# EAGLE schematic flip-clock (EAGLE 6.5.0)
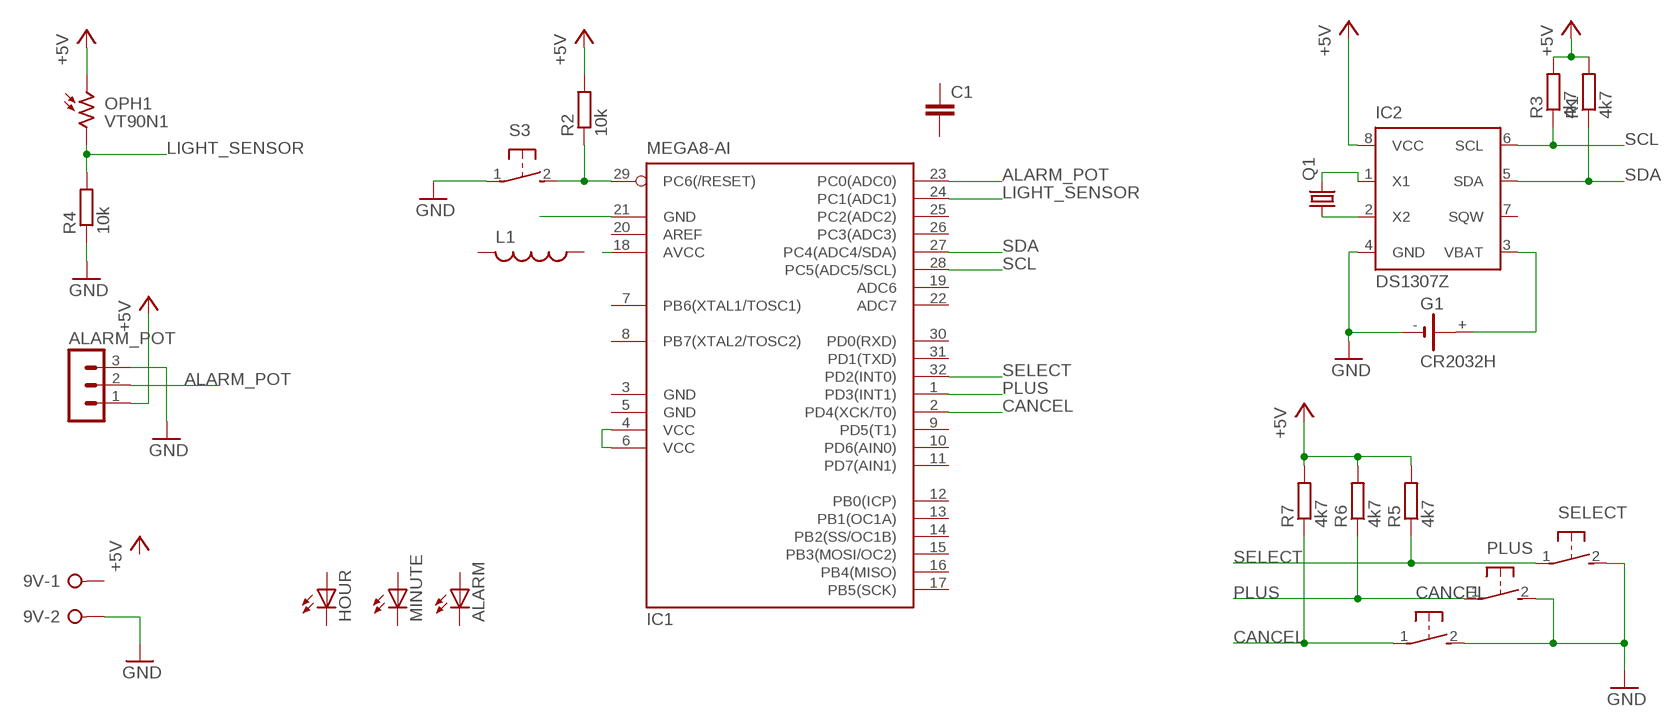
[diagram p0: schematic, sheet 1]

## Parts
9V  W237-02P  [W237-132]
ALARM  LED5MM  [LED5MM]
ALARM_POT  MA03-1  [MA03-1]
C1  C-EUC0805  [C0805]
CANCEL  31-XX  [B3F-31XX]
G1  CR2032H  [CR2032H]
HOUR  LED5MM  [LED5MM]
IC1  MEGA8-AI  [TQFP32-08]
IC2  DS1307Z  [SOIC8]
L1  L-US0204/7  [0204/7]
MINUTE  LED5MM  [LED5MM]
OPH1  VT90N1  [VT900]
PLUS  31-XX  [B3F-31XX]
Q1  CRYSTALTC26H  [TC26H]
R1  4k7  R-EU_M0805  [M0805]
R2  10k  R-EU_M0805  [M0805]
R3  4k7  R-EU_M0805  [M0805]
R4  10k  R-EU_M0805  [M0805]
R5  4k7  R-EU_M0805  [M0805]
R6  4k7  R-EU_M0805  [M0805]
R7  4k7  R-EU_M0805  [M0805]
S3  31-XX  [B3F-31XX]
SELECT  31-XX  [B3F-31XX]

## Nets
+5V: ALARM_POT.1 IC2.8(VCC) OPH1.1 R1.2 R2.2 R3.2 R5.2 R6.2 R7.2
ALARM_POT: ALARM_POT.2 IC1.23(PC0(ADC0))
CANCEL: CANCEL.1(P) IC1.2(PD4(XCK/T0)) R7.1
GND: 9V.2 ALARM_POT.3 CANCEL.2(S) G1.- IC2.4(GND) PLUS.2(S) R4.1 S3.1(P) SELECT.2(S)
LIGHT_SENSOR: IC1.24(PC1(ADC1)) OPH1.2 R4.2
N$1: IC2.1(X1) Q1.2
N$2: IC2.2(X2) Q1.1
N$3: IC1.29(PC6(/RESET)) R2.1 S3.2(S)
N$4: IC1.4(VCC) IC1.6(VCC)
N$5: IC1.18(AVCC)
N$6: G1.+ IC2.3(VBAT)
N$7: IC1.21(GND)
PLUS: IC1.1(PD3(INT1)) PLUS.1(P) R6.1
SCL: IC1.28(PC5(ADC5/SCL)) IC2.6(SCL) R3.1
SDA: IC1.27(PC4(ADC4/SDA)) IC2.5(SDA) R1.1
SELECT: IC1.32(PD2(INT0)) R5.1 SELECT.1(P)
Unconnected: 9V.1 ALARM.A ALARM.K(C) C1.1 C1.2 G1.+@1(+) HOUR.A HOUR.K(C) IC1.7(PB6(XTAL1/TOSC1)) IC1.8(PB7(XTAL2/TOSC2)) IC1.9(PD5(T1)) IC1.10(PD6(AIN0)) IC1.11(PD7(AIN1)) IC1.12(PB0(ICP)) IC1.13(PB1(OC1A)) IC1.14(PB2(SS/OC1B)) IC1.15(PB3(MOSI/OC2)) IC1.16(PB4(MISO)) IC1.17(PB5(SCK)) IC1.19(ADC6) IC1.20(AREF) IC1.22(ADC7) IC1.25(PC2(ADC2)) IC1.26(PC3(ADC3)) IC1.30(PD0(RXD)) IC1.31(PD1(TXD)) IC2.7(SQW) L1.1 L1.2 MINUTE.A MINUTE.K(C)

## Power pins joined to a net without a drawn wire
GND: IC1.3(GND) IC1.5(GND)

## Library data of the parts
9V = con-wago-508:W237-02P: WAGO SREW CLAMP; OC_FARNELL: unknown; OC_NEWARK: unknown
ALARM HOUR MINUTE = led:LED: LED OSRAM: - CHIPLED LG R971, LG N971, LY N971, LG Q971, LY Q971, LO R971, LY R971 LH N974, LH R974 LS Q976, LO Q976, LY Q976 LO Q996 - Hyper CHIPLED LW Q18S LB Q993, LB Q99A, LB R99A - SideLED LS A670, LO A670, LY A670, LG A670, LP A670 LB A673, LV A673, LT A673, LW A673 LH A674 LY A675 LS A676, LA A676, LO A676, LY A676, LW A676 LS A679, LY A679, LG A679 - Hyper Micro SIDELED® LS Y876, LA Y876, LO Y876, LY Y876 LT Y87S - SmartLED LW L88C, LW L88S LB L89C, LB L89S, LG L890 LS L89K, LO L89K, LY L89K LS L896, LA L896, LO L896, LY L896 - TOPLED LS T670, LO T670, LY T670, LG T670, LP T670 LSG T670, LSP T670, LSY T670, LOP T670, LYG T670 LG T671, LOG T671, LSG T671 LB T673, LV T673, LT T673, LW T673 LH T674 LS T676, LA T676, LO T676, LY T676, LB T676, LH T676, LSB T676, LW T676 LB T67C, LV T67C, LT T67C, LS T67K, LO T67K, LY T67K, LW E67C LS E67B, LA E67B, LO E67B, LY E67B, LB E67C, LV E67C, LT E67C LW T67C LS T679, LY T679, LG T679 LS T770, LO T770, LY T770, LG T770, LP T770 LB T773, LV T773, LT T773, LW T773 LH T774 LS E675, LA E675, LY E675, LS T675 LS T776, LA T776, LO T776, LY T776, LB T776 LHGB T686 LT T68C, LB T68C - Hyper Mini TOPLED® LB M676 - Mini TOPLED Santana® LG M470 LS M47K, LO M47K, LY M47K Source: http://www.osram.convergy.de LUXEON: - LUMILED® LXK2-PW12-R00, LXK2-PW12-S00, LXK2-PW14-U00, LXK2-PW14-V00 LXK2-PM12-R00, LXK2-PM12-S00, LXK2-PM14-U00 LXK2-PE12-Q00, LXK2-PE12-R00, LXK2-PE12-S00, LXK2-PE14-T00, LXK2-PE14-U00 LXK2-PB12-K00, LXK2-PB12-L00, LXK2-PB12-M00, LXK2-PB14-N00, LXK2-PB14-P00, LXK2-PB14-Q00 LXK2-PR12-L00, LXK2-PR12-M00, LXK2-PR14-Q00, LXK2-PR14-R00 LXK2-PD12-Q00, LXK2-PD12-R00, LXK2-PD12-S00 LXK2-PH12-R00, LXK2-PH12-S00 LXK2-PL12-P00, LXK2-PL12-Q00, LXK2-PL12-R00 Source: www.luxeon.com KINGBRIGHT: KA-3528ASYC Source: www.kingbright.com
ALARM_POT = con-lstb:MA03-1: PIN HEADER; OC_FARNELL: unknown; OC_NEWARK: unknown
C1 = rcl:C-EU: CAPACITOR, European symbol
CANCEL PLUS S3 SELECT = switch-omron:31-XX: OMRON SWITCH; MPN: B3F-3100; OC_FARNELL: 959704; OC_NEWARK: 36M3582
G1 = battery:CR2032H: LI BATTERY Varta
IC1 = atmel:MEGA8: MICROCONTROLLER 8 Kbytes FLASH, 1 kbytes SRAM, 512 bytes EEPROM, USART, 6-channel 10 bit ADC, 2-channel 8 bit ADC Pin compatible with Atmega48, ATMega88, ATMega168 Source: avr.lbr; MPN: ATMEGA8-16AU; OC_FARNELL: 9171371; OC_NEWARK: 73M8863
IC2 = ds1307_pcf8583:DS1307: I2C-Bus CLOCK/CALENDAR
L1 = rcl:L-US: INDUCTOR, American symbol
OPH1 = photo-elements:VT9: Photoconductive Cell VT900 Series Source: http://optoelectronics.perkinelmer.com/content/Datasheets/DTS_vt900seriesdatasheet.pdf
Q1 = crystal:CRYSTAL: CRYSTAL; OC_FARNELL: unknown; OC_NEWARK: unknown
R1-R7 = rcl:R-EU_: RESISTOR, European symbol